# Altium schematic sheet POWER.SchDoc
size B; Organization: Altium Limited; Address1: L3, 12a Rodborough Rd; Address2: Frenchs Forest; Address3: NSW; Address4: Australia 2086
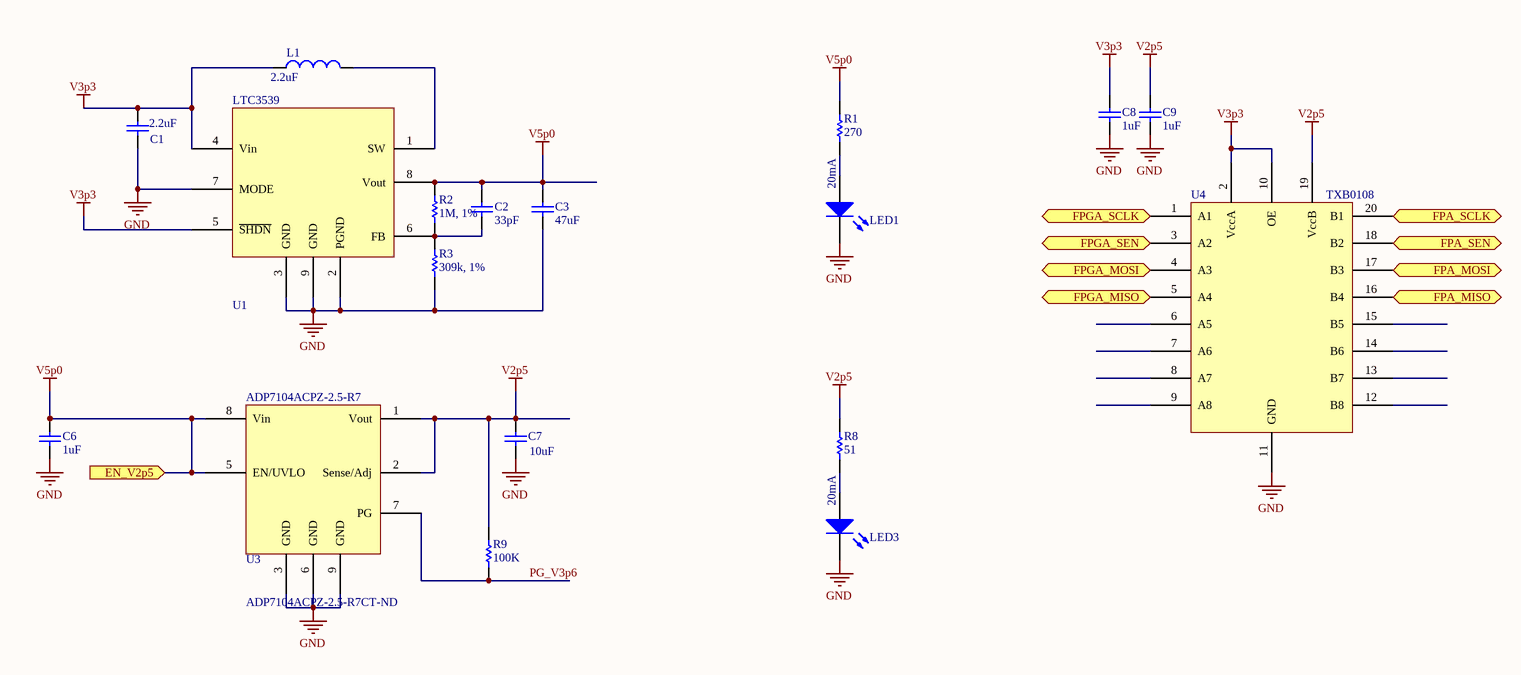
[diagram p0: POWER.SchDoc]

## Parts
C1  value 2.2uF  [CAPC1206(3216)170_N]  (hidden comment: 587-1329-2-ND)
C2  value 33pF  [CAPC01005(0402)22_N]  (hidden comment: CAP, 0402, 33pF)
C3  value 47uF  [CAPC1206(3216)170_N]  (hidden comment: CAP, 1206, 47uF)
C6  value 1uF  [CAPC01005(0402)22_N]  (hidden comment: CAP, 0402, 1uF)
C7  value 10uF  [CAPC0805(2012)130_N]  (hidden comment: CAP, 0805, 10uF)
C8  value 1uF  [CAPC01005(0402)22_N]  (hidden comment: CAP, 0402, 1uF)
C9  value 1uF  [CAPC01005(0402)22_N]  (hidden comment: CAP, 0402, 1uF)
L1  value 2.2uF  [INDUCTOR, SMD, TDK]  (hidden comment: INDUCTOR, SMD, 2.2uF)
LED1  LED, GREEN, 0603, LITE-ON  [0603, LED]  (value not drawn)
LED3  LED, GREEN, 0603, LITE-ON  [0603, LED]  (value not drawn)
R1  270  [RES, 0603]
R2  value 1M, 1%  [RESC0402(1005)_N]  (hidden comment: RES, 0402, 1M, 1%)
R3  value 309k, 1%  [RESC0402(1005)_N]  (hidden comment: RES, 0402, 309k, 1%)
R8  51  [RES, 0603]
R9  100K  [RES, 0603]
U1  LTC3539  [QFN45P300X200X80-8N]
U3  ADP7104ACPZ-2.5-R7  Supplier Part Number 1: ADP7104ACPZ-2.5-R7CT-ND  [QFN50P300X300X75-8N]
U4  TXB0108  [TSOP65P640X120-20N]

## Ports
EN_V2p5 (in), FPA_MISO (out), FPA_MOSI (out), FPA_SCLK (out), FPA_SEN (out), FPGA_MISO (in), FPGA_MOSI (in), FPGA_SCLK (in), FPGA_SEN (in)

## Nets
GND: C1.1 C3.1 C6.1 C7.1 C8.1 C9.1 LED1.1(C) LED3.1(C) R3.1 U1.2(PGND) U1.3(GND) U1.7(MODE) U1.9(GND) U3.3(GND) U3.6(GND) U3.9(GND) U4.11(GND)
V2p5: C7.2 C9.2 R8.2 R9.2 U3.1(Vout) U3.2(Sense/Adj) U4.19(VccB)
V3p3: C1.2 C8.2 L1.1 U1.4(Vin) U1.5(~{SHDN}) U4.2(VccA) U4.10(OE)
V5p0: C2.2 C3.2 C6.2 R1.2 R2.2 U1.8(Vout) U3.5(EN/UVLO) U3.8(Vin) ; port EN_V2p5
FPA_MISO: U4.16(B4) ; port FPA_MISO
FPA_MOSI: U4.17(B3) ; port FPA_MOSI
FPA_SCLK: U4.20(B1) ; port FPA_SCLK
FPA_SEN: U4.18(B2) ; port FPA_SEN
FPGA_MISO: U4.5(A4) ; port FPGA_MISO
FPGA_MOSI: U4.4(A3) ; port FPGA_MOSI
FPGA_SCLK: U4.1(A1) ; port FPGA_SCLK
FPGA_SEN: U4.3(A2) ; port FPGA_SEN
PG_V3p6: R9.1 U3.7(PG)
NetC2_1: C2.1 R2.1 R3.2 U1.6(FB)
NetL1_2: L1.2 U1.1(SW)
NetLED1_2: LED1.2(A) R1.1
NetLED3_2: LED3.2(A) R8.1

Not connected (* = marked no-connect by the designer): U4 6(A5) 7(A6) 8(A7) 9(A8) 12(B8) 13(B7) 14(B6) 15(B5)

## Notes on the sheet
- 20mA
- Title
- Size:
- Date:
- B
- Number:
- Time:
- Revision:
- Sheet
- of
- File:

## Library data of the parts
C1 = CAP, 1206, 2.2uF: Supplier 1: Digi-Key; Supplier Part Number 1: 587-1329-1-ND
R1 = RES_0603_270: Resistor, 0603, 1/10W, 270 ohm; Manufacturer: Panasonic Electronic Components; Manufacturer Part Number: ERJ-3EKF2700V; Description: RES 270 OHM 1/10W 1% 0603 SMD; Tolerance: ±1%; Power (Watts): 0.1W, 1/10W; Temperature Coefficient: ±100ppm/°C; Supplier 1: Digi-Key; RoHS: RoHS Compliant; Category: Resistors; Stock 1: 54092; Pricing 1: 1=0.1, 50=0.0138, 100=0.0105, 250=0.0078, 500=0.00576, 1000=0.00384 (USD); Packaging: Cut Tape (CT); Resistance (Ohms): 270; Composition: Thick Film; Features: -; Package / Case: 0603 (1608 Metric); Supplier Device Package: 0603; Size / Dimension: 0.063" L x 0.031" W (1.60mm x 0.80mm); Height: 0.022" (0.55mm); Number of Terminations: 2; ComponentLink1URL: http://industrial.panasonic.com/www-cgi/jvcr13pz.cgi?E+PZ+3+AOA0002+ERJ3EKF2700V+7+WW; ComponentLink1Description: http://industrial.panasonic.com/www-cgi/jvcr13pz.cgi?E+PZ+3+AOA0002+ERJ3EKF2700V+7+WW; Supplier Part Number 1: P270HCT-ND
R8 = RES_0603_51: Resistor, 0603, 1/10W, 51 ohm; Manufacturer: Panasonic Electronic Components; Manufacturer Part Number: ERJ-3EKF51R0V; Description: RES 51 OHM 1/10W 1% 0603 SMD; Tolerance: ±1%; Power (Watts): 0.1W, 1/10W; Temperature Coefficient: ±100ppm/°C; Supplier 1: Digi-Key; RoHS: RoHS Compliant; Category: Resistors; Stock 1: 80502; Pricing 1: 1=0.1, 50=0.0138, 100=0.0105, 250=0.0078, 500=0.00576, 1000=0.00384 (USD); Packaging: Cut Tape (CT); Resistance (Ohms): 51; Composition: Thick Film; Features: -; Package / Case: 0603 (1608 Metric); Supplier Device Package: 0603; Size / Dimension: 0.063" L x 0.031" W (1.60mm x 0.80mm); Height: 0.022" (0.55mm); Number of Terminations: 2; ComponentLink1URL: http://industrial.panasonic.com/www-cgi/jvcr13pz.cgi?E+PZ+3+AOA0002+ERJ3EKF51R0V+7+WW; ComponentLink1Description: http://industrial.panasonic.com/www-cgi/jvcr13pz.cgi?E+PZ+3+AOA0002+ERJ3EKF51R0V+7+WW; Supplier Part Number 1: P51.0HCT-ND
R9 = RES_0603_100K: Resistor, 0603, 1/10W, 100K ohm; Manufacturer: Panasonic Electronic Components; Manufacturer Part Number: ERJ-3EKF1003V; Description: RES 100K OHM 1/10W 1% 0603 SMD; Tolerance: ±1%; Power (Watts): 0.1W, 1/10W; Temperature Coefficient: ±100ppm/°C; Supplier 1: Digi-Key; RoHS: RoHS Compliant; Category: Resistors; Stock 1: 6711812; Pricing 1: 1=0.1, 50=0.0138, 100=0.0105, 250=0.0078, 500=0.00576, 1000=0.00384 (USD); Packaging: Cut Tape (CT); Resistance (Ohms): 100k; Composition: Thick Film; Features: -; Package / Case: 0603 (1608 Metric); Supplier Device Package: 0603; Size / Dimension: 0.063" L x 0.031" W (1.60mm x 0.80mm); Height: 0.022" (0.55mm); Number of Terminations: 2; ComponentLink1URL: http://industrial.panasonic.com/www-cgi/jvcr13pz.cgi?E+PZ+3+AOA0002+ERJ3EKF1003V+7+WW; ComponentLink1Description: http://industrial.panasonic.com/www-cgi/jvcr13pz.cgi?E+PZ+3+AOA0002+ERJ3EKF1003V+7+WW; Supplier Part Number 1: P100KHCT-ND
U1 = LTC3539: 2A, 1MHz/2MHz Synchronous Step-Up DC/DC Converters; Supplier 1: Digi-Key; Supplier Part Number 1: LTC3539EDCB#TRMPBFTR-ND
U3 = ADP7104ACPZ-2.5-R7: 2.5V Voltage Regulator; Supplier 1: Digi-Key
U4 = TXB0108; 8-bit Bi-Directional Voltage Translator: Supplier 1: Digi-Key; Supplier Part Number 1: 296-21527-2-ND
C2 = CAP, 0402, 33pF: Supplier 1: Digi-Key; Supplier Part Number 1: 587-1205-1-ND
C3 = CAP, 1206, 47uF: Supplier 1: Digi-Key; Supplier Part Number 1: 445-8047-1-ND
C6 C8 C9 = CAP, 0402, 1uF: Supplier 1: Digi-Key; Supplier Part Number 1: 587-3245-1-ND
C7 = CAP, 0805, 10uF: Supplier 1: Digi-Key; Supplier Part Number 1: 587-2985-1-ND
L1 = INDUCTOR, SMD, 2.2uF: Supplier 1: Digi-Key; Supplier Part Number 1: 445-4242-1-ND
LED1 LED3 = LED, GREEN, 0603, LITE-ON: Supplier 1: Digi-Key; Supplier Part Number 1: 160-1446-1-ND
R2 = RES, 0402, 1M, 1%: Supplier 1: Digi-Key; Supplier Part Number 1: P1.00MLCT-ND
R3 = RES, 0402, 309k, 1%: Supplier 1: Digi-Key; Supplier Part Number 1: RHM309KBHCT-ND